# Altium project Pixel1.0_4.PrjPcb
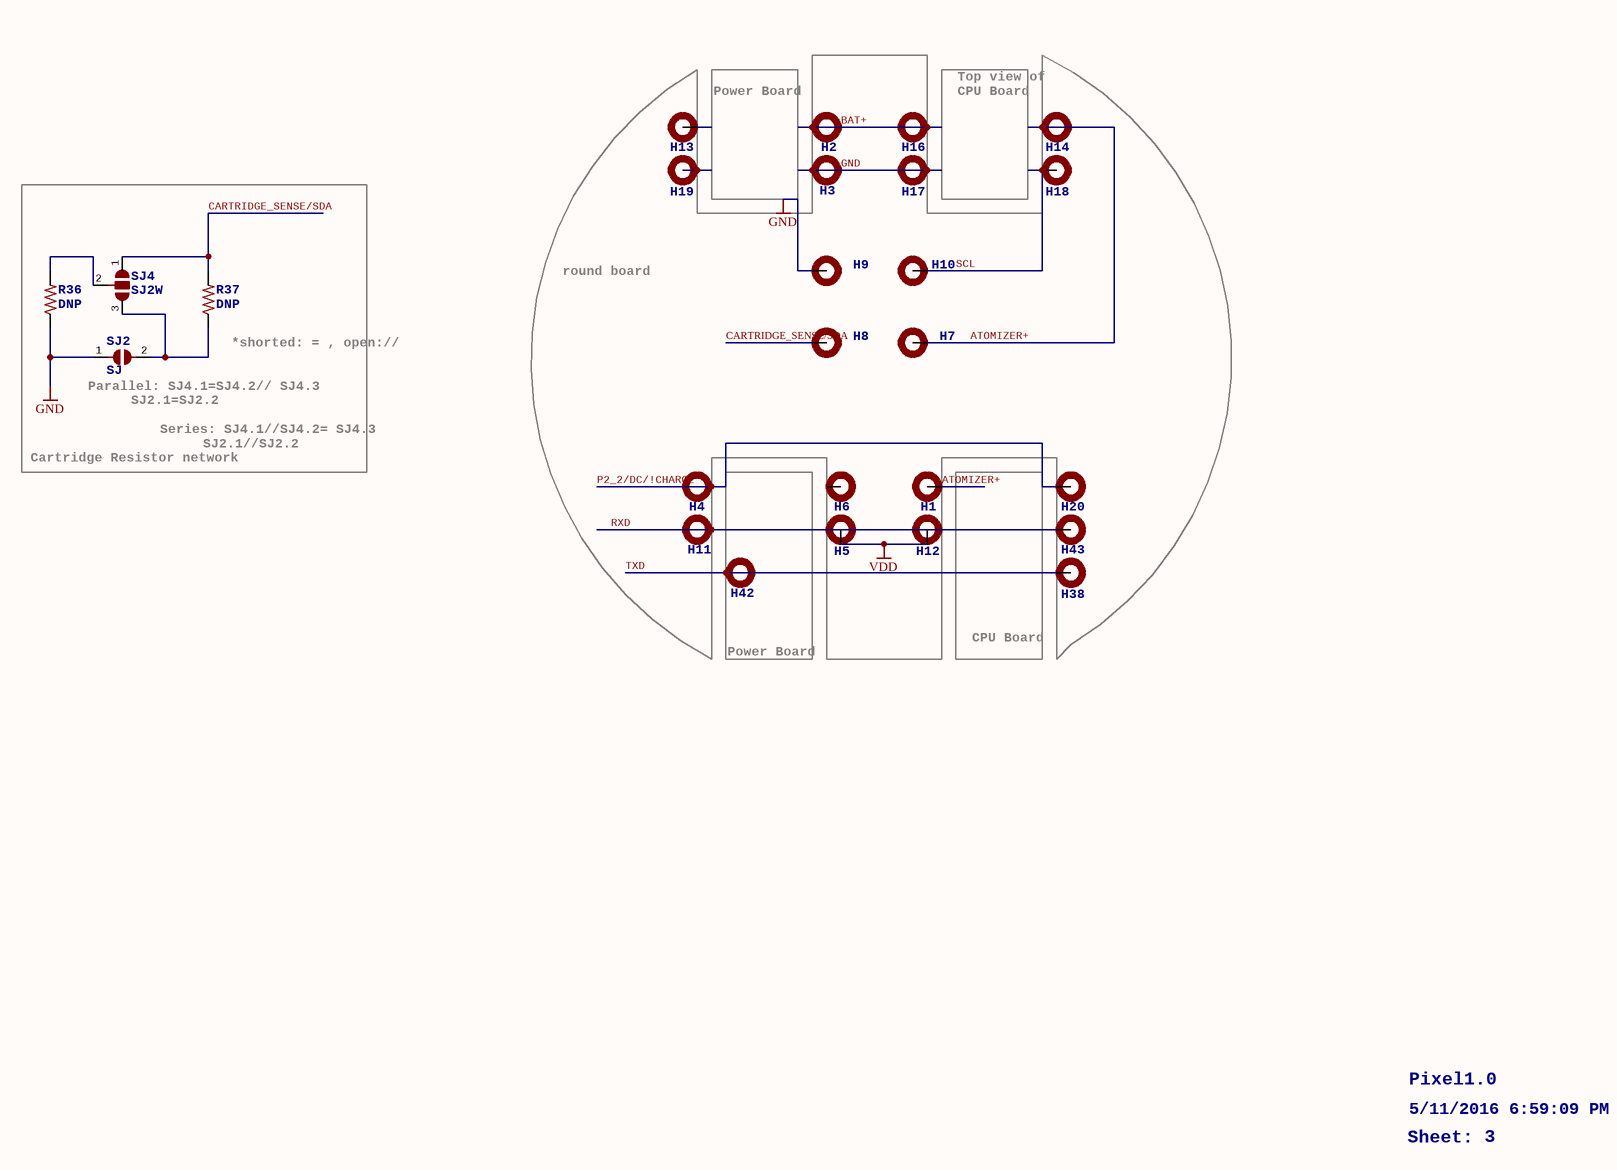
[diagram p0: Pixel1.0_2.SchDoc]
1 sheet, 26 parts. Net scope: global (net labels, ports and power ports of the same name join across sheets).
Board file: Pixel1.0_4.PcbDoc

## Sheet Pixel1.0_2.SchDoc: Pixel1.0
size 409 x 282 mm; Date: 5/11/2016 6:59:09 PM; SheetNumber: 3

### Parts
H1  MOUNT-PAD-ROUNDTMOUNT2  [TMOUNT2]  (value not drawn)
H2  MOUNT-PAD-ROUNDTMOUNT2  [TMOUNT2]  (value not drawn)
H3  MOUNT-PAD-ROUNDTMOUNT2  [TMOUNT2]  (value not drawn)
H4  MOUNT-PAD-ROUNDTMOUNT2  [TMOUNT2]  (value not drawn)
H5  MOUNT-PAD-ROUNDTMOUNT2  [TMOUNT2]  (value not drawn)
H6  MOUNT-PAD-ROUNDTMOUNT2  [TMOUNT2]  (value not drawn)
H7  MOUNT-PAD-ROUND2.8  [2,0-PAD]  (value not drawn)
H8  MOUNT-PAD-ROUND2.8  [2,0-PAD]  (value not drawn)
H9  MOUNT-PAD-ROUND2.8  [2,0-PAD]  (value not drawn)
H10  MOUNT-PAD-ROUND2.8  [2,0-PAD]  (value not drawn)
H11  MOUNT-PAD-ROUNDTRAPEZOID  [TMOUNT5]  (value not drawn)
H12  MOUNT-PAD-ROUNDTMOUNT2  [TMOUNT2]  (value not drawn)
H13  MOUNT-PAD-ROUNDTMOUNT3  [TMOUNT3]  (value not drawn)
H14  MOUNT-PAD-ROUNDTMOUNT3  [TMOUNT3]  (value not drawn)
H16  MOUNT-PAD-ROUNDTMOUNT2  [TMOUNT2]  (value not drawn)
H17  MOUNT-PAD-ROUNDTMOUNT2  [TMOUNT2]  (value not drawn)
H18  MOUNT-PAD-ROUNDTMOUNT2  [TMOUNT2]  (value not drawn)
H19  MOUNT-PAD-ROUNDTMOUNT2  [TMOUNT2]  (value not drawn)
H20  MOUNT-PAD-ROUNDTMOUNT2  [TMOUNT2]  (value not drawn)
H38  MOUNT-PAD-ROUNDTRAPEZOID  [TMOUNT5]  (value not drawn)
H42  MOUNT-PAD-ROUNDMIRROR  [TMOUNTTRAPMIRROR]  (value not drawn)
H43  MOUNT-PAD-ROUNDMIRROR  [TMOUNTTRAPMIRROR]  (value not drawn)
R36  DNP  [R0201]
R37  DNP  [R0201]
SJ2  SJ  [SJ]
SJ4  SJ2W  [SJ_2]

### Blocks framed on the sheet
Power Board: H42

### Nets
GND: H3.1(MOUNT) H9.1(MOUNT) H17.1(MOUNT) R36.1 SJ2.1
VDD: H5.1(MOUNT) H12.1(MOUNT)
ATOMIZER+: H1.1(MOUNT) H7.1(MOUNT) H14.1(MOUNT)
BAT+: H2.1(MOUNT) H16.1(MOUNT)
CARTRIDGE_SENSE/SDA: H8.1(MOUNT) R37.2 SJ4.1
P2_2/DC/!CHARGE: H4.1(MOUNT) H20.1(MOUNT)
RXD: H11.1(MOUNT) H43.1(MOUNT)
SCL: H10.1(MOUNT) H18.1(MOUNT)
TXD: H38.1(MOUNT) H42.1(MOUNT)
NetR36_2: R36.2 SJ4.2
NetR37_1: R37.1 SJ2.2 SJ4.3

Not connected (* = marked no-connect by the designer): H6 1(MOUNT); H13 1(MOUNT); H19 1(MOUNT)

### Notes on the sheet
- Power Board
- Top view of
- CPU Board
- round board
- (near SJ2) Parallel: SJ4.1=SJ4.2// SJ4.3
- (near R37) *shorted: = , open://
- Cartridge Resistor network
- (near SJ2) SJ2.1=SJ2.2
- Series: SJ4.1//SJ4.2= SJ4.3
- SJ2.1//SJ2.2
- Pixel1.0
- 5/11/2016 6:59:09 PM
- Sheet:
- 3
- 1
- 2
- 4
- 5
- 6
- 7
- 8
- A
- B
- C
- D
- E

### Library data of the parts
H1-H6 H12 H16-H20 = MOUNT-PAD-ROUNDTMOUNT2: MOUNTING PAD, round
H7-H10 = MOUNT-PAD-ROUND2.8: MOUNTING PAD, round
H11 H38 = MOUNT-PAD-ROUNDTRAPEZOID: MOUNTING PAD, round
H13 H14 = MOUNT-PAD-ROUNDTMOUNT3: MOUNTING PAD, round
H42 H43 = MOUNT-PAD-ROUNDMIRROR: MOUNTING PAD, round
R36 R37 = R-US_R0201: RESISTOR, American symbol
SJ2 = SJ: SMD solder JUMPER
SJ4 = SJ2W: SMD solder JUMPER